# Altium schematic sheet GPIO_Expander.SchDoc
size A4; Organization: UltraZohm; SheetNumber: 5; SheetTotal: 7; Website: www.ultrazohm.com
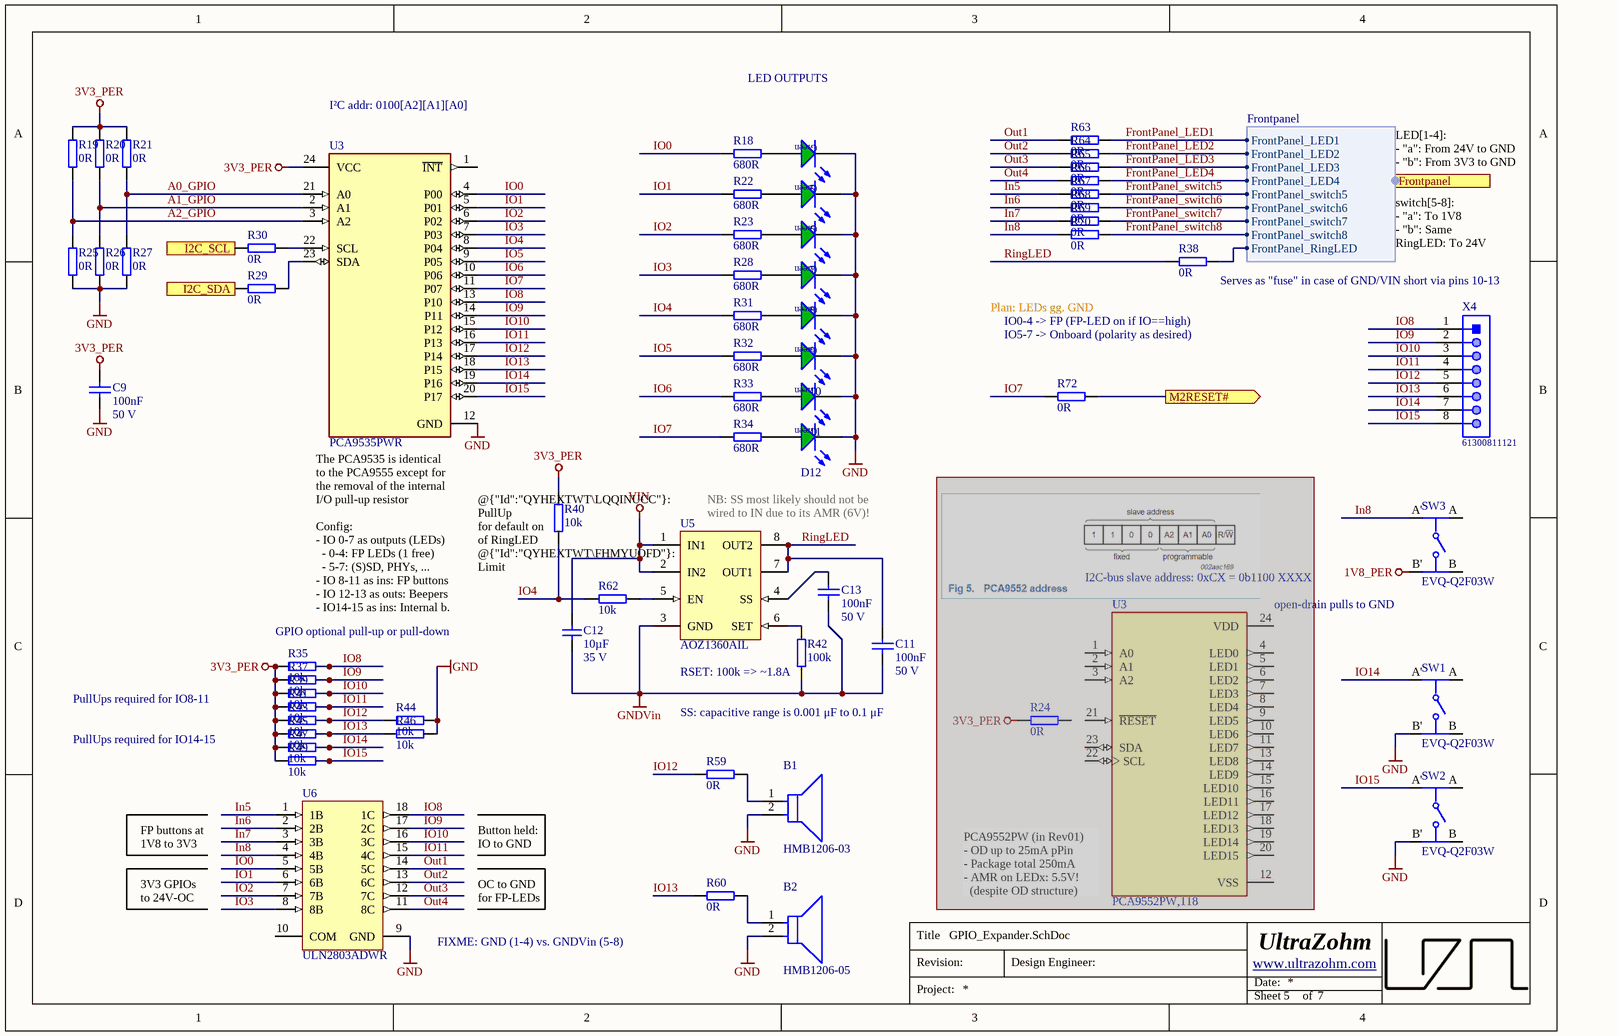
[diagram p0: GPIO_Expander.SchDoc]

## Parts
(Parts that share a designator on the sheet are numbered #1, #2 ... from top to bottom, then left to right.)
B1  HMB1206-03  [THT12X6]
B2  HMB1206-05  [THT12X6]
C9  Rated Voltage: 50 V  [C_0603(1608)100_L]  (hidden comment: 100nF)
C11  Rated Voltage: 50 V  [C_0603(1608)100_L]  (hidden comment: 100nF)
C12  10µF  Voltage: 35 V  [C_1206]
C13  Rated Voltage: 50 V  [C_0603(1608)100_L]  (hidden comment: 100nF)
D5  150060GS75000  [WL-SMCW_0603]  (value not drawn)
D6  150060GS75000  [WL-SMCW_0603]  (value not drawn)
D7  150060GS75000  [WL-SMCW_0603]  (value not drawn)
D8  150060GS75000  [WL-SMCW_0603]  (value not drawn)
D9  150060GS75000  [WL-SMCW_0603]  (value not drawn)
D10  150060GS75000  [WL-SMCW_0603]  (value not drawn)
D11  150060GS75000  [WL-SMCW_0603]  (value not drawn)
D12  150060GS75000  [WL-SMCW_0603]  (value not drawn)
R18  680R  [R_0603_N]
R19  0R  [R_0603_N]
R20  0R  [R_0603_N]
R21  0R  [R_0603_N]
R22  680R  [R_0603_N]
R23  680R  [R_0603_N]
R24  0R  [R_0603_N]  (masked out: inside a compile mask, not in the netlist)
R25  0R  [R_0603_N]
R26  0R  [R_0603_N]
R27  0R  [R_0603_N]
R28  680R  [R_0603_N]
R29  0R  [R_0603_N]
R30  0R  [R_0603_N]
R31  680R  [R_0603_N]
R32  680R  [R_0603_N]
R33  680R  [R_0603_N]
R34  680R  [R_0603_N]
R35  10k  [R_0603_N]
R37  10k  [R_0603_N]
R38  0R  [R_0603_N]
R39  10k  [R_0603_N]
R40  10k  [R_0603_N]
R41  10k  [R_0603_N]
R42  100k  [R_0603_N]
R43  10k  [R_0603_N]
R44  10k  [R_0603_N]
R45  10k  [R_0603_N]
R46  10k  [R_0603_N]
R47  10k  [R_0603_N]
R49  10k  [R_0603_N]
R59  0R  [R_0603_N]
R60  0R  [R_0603_N]
R62  10k  [R_0603_N]
R63  0R  [R_0603_N]
R64  0R  [R_0603_N]
R65  0R  [R_0603_N]
R66  0R  [R_0603_N]
R67  0R  [R_0603_N]
R68  0R  [R_0603_N]
R69  0R  [R_0603_N]
R70  0R  [R_0603_N]
R72  0R  [R_0603_N]
SW1  EVQ-Q2F03W  [FP-EVQ-Q2F03W-MFG]
SW2  EVQ-Q2F03W  [FP-EVQ-Q2F03W-MFG]
SW3  EVQ-Q2F03W  [FP-EVQ-Q2F03W-MFG]
U3#1  PCA9535PWR  [FP-PW0024A-MFG]
U3#2  PCA9552PW,118  [SOP65P640X110-24N]  (masked out: inside a compile mask, not in the netlist)
U5  AOZ1360AIL  [SOIC127P600X175-8N]
U6  ULN2803ADWR  [DW0018A_L]
X4  61300811121  [61300811121]

## Ports
Frontpanel (harness Frontpanel), I2C_SCL, I2C_SDA, M2RESET# (out)

## Harnesses
Frontpanel: FrontPanel_LED1, FrontPanel_LED2, FrontPanel_LED3, FrontPanel_LED4, FrontPanel_switch5, FrontPanel_switch6, FrontPanel_switch7, FrontPanel_switch8, FrontPanel_RingLED

## Nets
1V8_PER: SW3.B'
3V3_PER: C9.1 R19.1 R20.1 R21.1 R35.2 R37.2 R39.2 R40.1 R41.2 R43.2 R45.2 R47.2 R49.2 U3#1.24(VCC)
GND: B1.2 B2.2 C9.2 D5.1(K) D6.1(K) D7.1(K) D8.1(K) D9.1(K) D10.1(K) D11.1(K) D12.1(K) R25.2 R26.2 R27.2 R44.1 R46.1 SW1.B' SW2.B' U3#1.12(GND) U6.9(GND)
GNDVin: C11.2 C12.1 C13.2 R42.2 U5.3(GND)
VIN: C12.2 U5.1(IN1) U5.2(IN2)
A0_GPIO: R21.2 R27.1 U3#1.21(A0)
A1_GPIO: R20.2 R26.1 U3#1.2(A1)
A2_GPIO: R19.2 R25.1 U3#1.3(A2)
FrontPanel_LED1: R63.2 ; port Frontpanel.FrontPanel_LED1
FrontPanel_LED2: R64.2 ; port Frontpanel.FrontPanel_LED2
FrontPanel_LED3: R65.2 ; port Frontpanel.FrontPanel_LED3
FrontPanel_LED4: R66.2 ; port Frontpanel.FrontPanel_LED4
FrontPanel_switch5: R67.2 ; port Frontpanel.FrontPanel_switch5
FrontPanel_switch6: R68.2 ; port Frontpanel.FrontPanel_switch6
FrontPanel_switch7: R69.2 ; port Frontpanel.FrontPanel_switch7
FrontPanel_switch8: R70.2 ; port Frontpanel.FrontPanel_switch8
I2C_SCL: R30.1 ; port I2C_SCL
I2C_SDA: R29.1 ; port I2C_SDA
In5: R67.1 U6.1(1B)
In6: R68.1 U6.2(2B)
In7: R69.1 U6.3(3B)
In8: R70.1 SW3.A' U6.4(4B)
IO0: R18.1 U3#1.4(P00) U6.5(5B)
IO1: R22.1 U3#1.5(P01) U6.6(6B)
IO2: R23.1 U3#1.6(P02) U6.7(7B)
IO3: R28.1 U3#1.7(P03) U6.8(8B)
IO4: R31.1 R40.2 R62.1 U3#1.8(P04)
IO5: R32.1 U3#1.9(P05)
IO6: R33.1 U3#1.10(P06)
IO7: R34.1 R72.1 U3#1.11(P07)
IO8: R35.1 U3#1.13(P10) U6.18(1C) X4.1
IO9: R37.1 U3#1.14(P11) U6.17(2C) X4.2
IO10: R39.1 U3#1.15(P12) U6.16(3C) X4.3
IO11: R41.1 U3#1.16(P13) U6.15(4C) X4.4
IO12: R43.1 R44.2 R59.1 U3#1.17(P14) X4.5
IO13: R45.1 R46.2 R60.1 U3#1.18(P15) X4.6
IO14: R47.1 SW1.A' U3#1.19(P16) X4.7
IO15: R49.1 SW2.A' U3#1.20(P17) X4.8
M2RESET#: R72.2 ; port M2RESET#
Out1: R63.1 U6.14(5C)
Out2: R64.1 U6.13(6C)
Out3: R65.1 U6.12(7C)
Out4: R66.1 U6.11(8C)
RingLED: C11.1 R38.1 U5.7(OUT1) U5.8(OUT2)
NetB1_1: B1.1 R59.2
NetB2_1: B2.1 R60.2
NetC13_1: C13.1 U5.4(SS)
NetD5_2: D5.2(A) R18.2
NetD6_2: D6.2(A) R22.2
NetD7_2: D7.2(A) R23.2
NetD8_2: D8.2(A) R28.2
NetD9_2: D9.2(A) R31.2
NetD10_2: D10.2(A) R32.2
NetD11_2: D11.2(A) R33.2
NetD12_2: D12.2(A) R34.2
NetR29_2: R29.2 U3#1.23(SDA)
NetR30_2: R30.2 U3#1.22(SCL)
NetR38_2: R38.2 ; port Frontpanel.FrontPanel_RingLED
NetR42_1: R42.1 U5.6(SET)
NetR62_2: R62.2 U5.5(EN)

Not connected (* = marked no-connect by the designer): SW1 A B; SW2 A B; SW3 A B; U3#1 1(~{INT}); U6 10(COM)

## Notes on the sheet
- I²C addr: 0100[A2][A1][A0]
- LED OUTPUTS
- LED[1-4]:
  - "a": From 24V to GND
  - "b": From 3V3 to GND
- switch[5-8]:
  - "a": To 1V8
  - "b": Same
- RingLED: To 24V
- Plan: LEDs gg. GND
- (near R38) Serves as "fuse" in case of GND/VIN short via pins 10-13
- IO0-4 -> FP (FP-LED on if IO==high)
- IO5-7 -> Onboard (polarity as desired)
- (near U5) NB: SS most likely should not be wired to IN due to its AMR (6V)!
- (near R40) @{"Id":"QYHEXTWT\LQQINUCC"}: PullUp
  for default on
  of RingLED
  @{"Id":"QYHEXTWT\FHMYUOFD"}: Limit
  EN current if
  GND rails lift
- (near U3#2) I2C-bus slave address: 0xCX = 0b1100 XXXX
- GPIO optional pull-up or pull-down
- (near U3#1) The PCA9535 is identical to the PCA9555 except for the removal of the internal I/O pull-up resistor
  Config:
  - IO 0-7 as outputs (LEDs)
  - 0-4: FP LEDs (1 free)
  - 5-7: (S)SD, PHYs, ...
  - IO 8-11 as ins: FP buttons
  - IO 12-13 as outs: Beepers
  - IO14-15 as ins: Internal b.
- open-drain pulls to GND
- PullUps required for IO8-11
- SS: capacitive range is 0.001 μF to 0.1 μF
- (near R42) RSET: 100k => ~1.8A
- PullUps required for IO14-15
- FP buttons at 1V8 to 3V3
- Button held: IO to GND
- 3V3 GPIOs to 24V-OC
- OC to GND for FP-LEDs
- (near U3#2) PCA9552PW (in Rev01)
  - OD up to 25mA pPin
  - Package total 250mA
  - AMR on LEDx: 5.5V!
  (despite OD structure)
- FIXME: GND (1-4) vs. GNDVin (5-8)
- Title
- Revision:
- Design Engineer:
- Date:
- Project:
- Sheet
- of

## Library data of the parts
B1 B2 = Buzzer: AUDIO PIEZO BUZZER THT; Device Class L3: Buzzers; ComponentLink2Description: Datasheet; ComponentLink2URL: https://www.murata.com/en-global/products/productdata/8801054425118/SPEC-PKLCS1212E2000-R1.pdf?1517839212000
  B1: LCSC Part #: C96101; Value: HMB1206-03
  B2: LCSC Part #: C96095; Value: HMB1206-05
C9 C11 C13 = C_0603: CAP 0603 (1608 Metric) SMD; Tolerance: ±5%; Case-Metric: 1608; Case-EIA: 0603; Max Thickness: 1 mm; Technology: SMT; Created: 2018_09_06_AGeiger; Dielectric: *; Supplier 1: *; Supplier Part Number 1: *; MF: *; MPN: *; Value: 100nF; Package: 0603; LCSC Part #: C14663
C12 = C_1206: Capacitor 1206; MPN: GMK316BJ106KL-T; Tolerance: 10%; MF: Taiyo Yuden; Dielectric: X5R; Package: 1206; Value: 10µF; Created: 2018_06_25_AGeiger; Supplier 1: Mouser; Supplier Part Number 1: 963-GMK316BJ106KL-T; LCSC Part #: C13585
D5-D12 = LED_Green_0603: WL-SMCW SMD Mono-color Chip LED Waterclear, size 0603, Green, 3.2 V, 140°; Forward Voltage: 3.2 V; Luminous Intensity: 430 mcd; Peak Wavelength: 515 nm; Dominant Wavelength: 520 nm; MF: Wuerth Elektronik; Published Date: Sep. 2017; ComponentLink1Description: Manufacturer; ComponentLink1URL: http://www.we-online.de; ComponentLink2Description: Datasheet; ComponentLink2URL: http://katalog.we-online.com/led/datasheet/150060GS75000.pdf; MPN: 150060GS75000; Size: 0603; Viewing Angle: 140°; Emitting Color: Green; Value: 150060GS75000; Package: 0603; Created: 2018_09_06_AGeiger; Supplier 1: Farnell; Supplier Part Number 1: 2322070; Supplier 2: Mouser; Supplier Part Number 2: 710-150060GS75000; Supplier 3: Digi-Key; Supplier Part Number 3: 732-4971-1-ND; LCSC Part #: C72043
R18 R22 R23 R28 R31-R34 = R_0603: SMD Resistor 0603; MPN: CR0603-FX-3901ELF; Tolerance: 1%; Voltage: 75V; Power: 100 mW; MF: Bourns; Package: 0603; Value: 680R; Created: 2018_09_06_AGeiger; Supplier 1: Mouser; Supplier Part Number 1: 652-CR0603-FX3901ELF; LCSC Part #: C23228
R19-R21 R24-R27 R29 R30 R38 R59 R60 R63-R70 R72 = R_0603_JLC: SMD Resistor 0603; Tolerance: 1%; Voltage: 75V; Power: 100 mW; Package: 0603; Value: 0R; Created: 2018_09_06_AGeiger; Supplier 1: Mouser; Supplier Part Number 1: 71-CRCW06030000Z0EBC; LCSC Part #: C21189
R35 R37 R39-R41 R43-R47 R49 R62 = R_0603: SMD Resistor 0603; MPN: RC0603FR-072KL; Tolerance: 1%; Voltage: 75 V; Power: 100 mW; MF: Yageo; Package: 0603; Value: 10k; Created: 2018_09_06_AGeiger; Supplier 1: Mouser; Supplier Part Number 1: 603-RC0603FR-1010KL; LCSC Part #: C25804
R42 = R_0603: SMD Resistor 0603; Package: 0603; Value: 100k; LCSC Part #: C25803
SW1-SW3 = CMP-05618-000127-1: SWITCH TACTILE SPST-NO 0.02A 15V; Body Depth: 6mm; Illumination Type: Non-Illuminated; Mechanical Life: 1000000Cycles; Switch Travel: 0.2mm; Actuator Length: 1.3mm; Max Voltage Rating (AC): 250V; Contact Resistance: 100mR; Operating Force: 1N; Current Rating: 20mA; Switch Function: Off-Mom; Actuator Color: White; Number of Poles: 1; Throw Configuration: SPST; Actuator Type: Standard; Contact Plating: Gold; Lead Free: Lead Free; Package Quantity: 1; Radiation Hardening: No; Depth: 6.6mm; Termination: SMD/SMT; Voltage Rating (AC): 250V; Size: 1.8mm; Thickness: 1.8mm; Height: 3.1mm; Mount: Surface Mount; Contact Current Rating: 20mA; Color: White; Width: 6.5mm; Series: EVQQ2; Max Operating Temperature: 85°C; Min Operating Temperature: -40°C; Packaging: Tape and Reel; Voltage Rating (DC): 15V; RoHS Compliant: Yes; Length: 6mm; Max Voltage Rating (DC): 15V; Max Current Rating: 20mA; Case/Package: SMD/SMT; Orientation: Straight; Electrical Life: 1000000Cycles; LCSC Part #: C318884
U3#1 = CMP-04886-000006-1: IC I/O EXPANDER I2C 16B 24TSSOP; Output Current: 25mA; Max Frequency: 400kHz; Number of Outputs: 2; Min Supply Voltage: 2.3V; Operating Supply Current: 100uA; Max Supply Voltage: 5.5V; Number of I/Os: 16; Min Operating Temperature: -40°C; Weight: 0.003157oz; Packaging: Tape and Reel; Series: -; Package Quantity: 1; Number of Pins: 24; Interface: I2C; Lead Free: Lead Free; Case/Package: TSSOP; Frequency: 400kHz; Mount: Surface Mount; Max Operating Temperature: 85°C; REACH SVHC: No SVHC; RoHS Compliant: Yes; LCSC Part #: C255606
U3#2 = PCA9552PW,118: LED Driver IC 16 Output Power Switch IÂ²C Dimming 25mA 24-TSSOP; MF: NXP USA; Package: TSSOP-24 NXP Semiconductors; MP: PCA9552PW,118; Digi-Key_Part_Number: 568-11924-1-ND; SnapEDA_Link: https://www.snapeda.com/parts/PCA9552PW,118/NXP%20USA%20Inc./view-part/575754/?ref=snap; Value: *; Digi-Key_Purchase_URL: https://www.digikey.com/product-detail/en/nxp-usa-inc/PCA9552PW,118/568-11924-1-ND/5221886?utm_source=snapeda&utm_medium=aggregator&utm_campaign=symbol; LCSC Part #: C129513
U5 = AOZ1360AIL: 28V Programmable Current-Limited Load Switch; Manufacturer: Alpha and Omega Semiconductor; VCC(Max)(V): 28; Peak Output Current(A): 3.4; Driver Configuration: High Side; No. of Outputs: 1; Input Threshold: CMOS, TTL; VCC(Min)(V): 5.5; ComponentLink1URL: http://aosmd.com/res/data_sheets/AOZ1360AIL.pdf; ComponentLink1Description: Datasheet; PackageDescription: 8-Pin Plastic Small Outline Integrated Circuit, 4.9 x 3.9 mm, Pitch 1.27 mm Pitch; PartNumber: AOZ1360AIL; Mounting Technology: Surface Mount; LCSC Part #: C146821
U6 = CMP-2000-07354-1: Darlington Transistor Array, -40 to 85 degC, 18-Pin SOIC (DW), Green (RoHS & no Sb/Br), Tape and Reel; Manufacturer: Texas Instruments; Package Version: 4040000-3/G, 01/2011; Other Names: 296-15777-6; Voltage - Supply: 5V; IR Max: 50uA; Number of Drivers/Receivers: 8/0; VF: 1.7V; Dynamic Catalog: DarlingtonArrays; Package Description: 18-Pin Plastic Small Outline, Body 11.55 x 7.5 mm, Pitch 1.27 mm; Mounting Technology: SurfaceMount; Packaging: Digi-Reel®; Protocol: -; Family: Interface-Drivers,Receivers,Transceivers; Package Reference: DW18; Mounting Type: SurfaceMount; Type: DarlingtonArray; Category: IntegratedCircuits(ICs); Series: -; PartNumber: ULN2803A; Manufacturer URL: http://www.ti.com/; Package / Case: 18-SOIC(0.295",7.50mmWidth); Standard Package: 1; Datasheet Version: Rev. G, 01/2015; Supplier Device Package: 18-SOIC; Package URL: http://www.ti.com/lit/ml/mpds172a/mpds172a.pdf; Datasheet URL: http://www.ti.com/lit/ds/symlink/uln2803a.pdf; LCSC Part #: C181731
X4 = CMP-1502-01076-1: THT Vertical Pin Header WR-PHD, Pitch 2.54 mm, Single Row, 8 pins; Manufacturer: Wurth Elektronik; Rated Current: 3A; Pin Number: 8; Working Voltage: 250VAC; Gender: Male; Contact Resistance: 20mOhm; Pitch: 2.54mm; Withstanding Voltage: 500VAC; Publisher: WurthElektronik; Operating Temperature: -40to105degC; Orientation: Vertical; Row Number: Single; Part Number: 61300811121; Package Reference: 61300811121; Mounting Technology: THT; Packaging: Bag; Manufacturer URL: http://www.we-online.de; Datasheet URL: https://katalog.we-online.de/em/datasheet/6130xx11121.pdf; LCSC Part #: C190820